# Altium schematic sheet Harvester_RF.SchDoc
size A; SheetNumber: 5
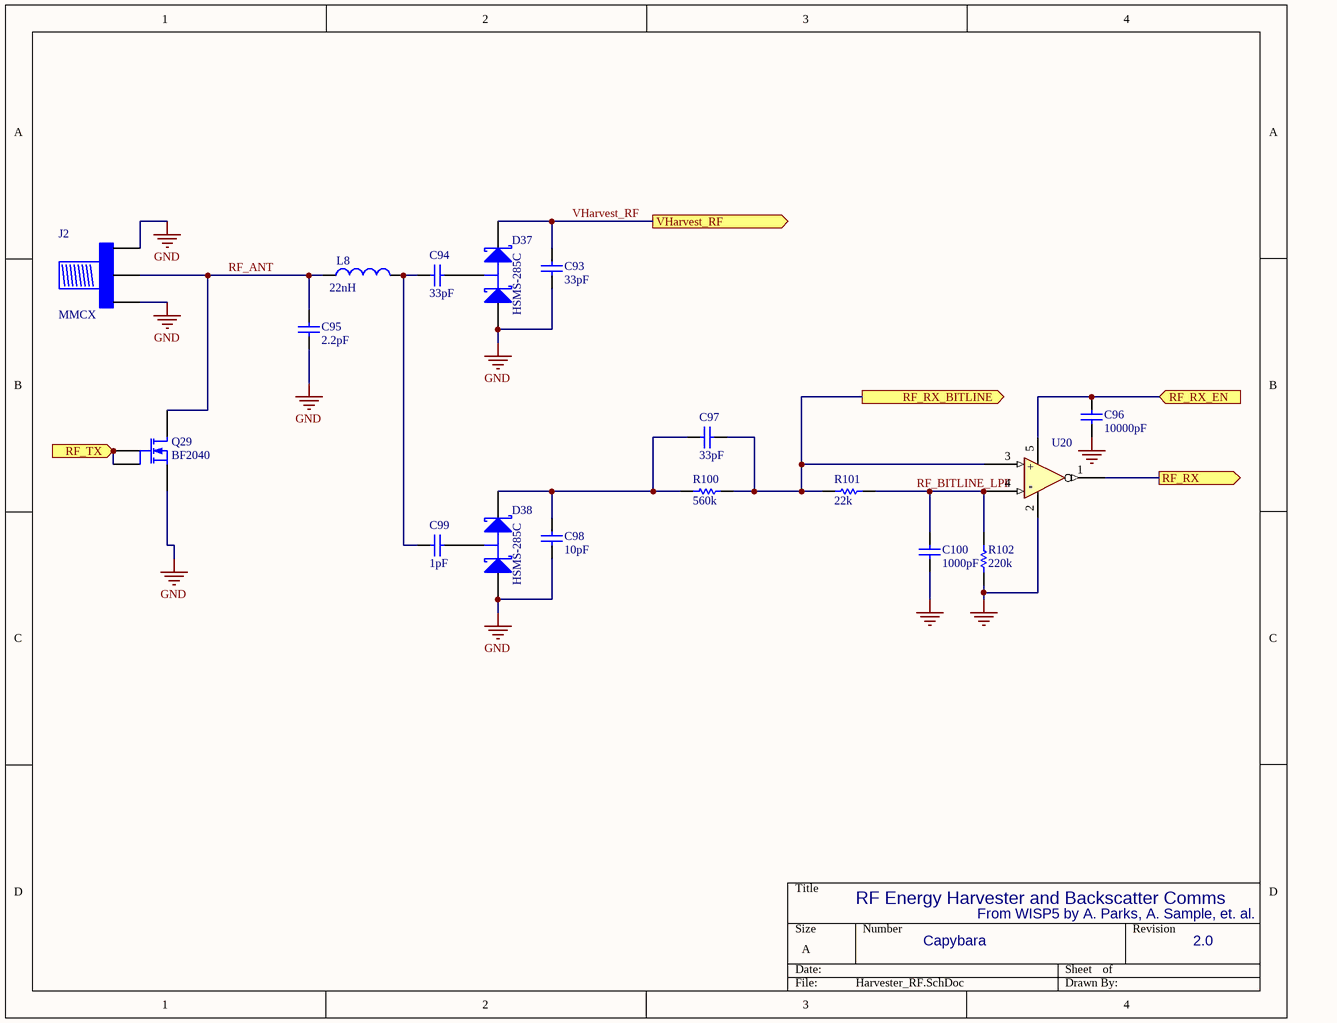
[diagram p0: Harvester_RF.SchDoc]

## Parts
C93  value 33pF  [0402]  (hidden comment: Cap)
C94  value 33pF  [0402]  (hidden comment: Cap)
C95  value 2.2pF  [0402]  (hidden comment: Cap)
C96  value 10000pF  [0402]  (hidden comment: Cap)
C97  value 33pF  [0402]  (hidden comment: Cap)
C98  value 10pF  [0402]  (hidden comment: Cap)
C99  value 1pF  [0402]  (hidden comment: Cap)
C100  value 1000pF  [0402]  (hidden comment: Cap)
D37  HSMS-285C  [SOT-323, HSMS-285C]
D38  HSMS-285C  [SOT-323, HSMS-285C]
J2  MMCX  [MMCX-TH]
L8  value 22nH  [0402]  (hidden comment: Ind)
Q29  BF2040  [SOT-143]
R100  value 560k  [0402]  (hidden comment: Res)
R101  value 22k  [0402]  (hidden comment: Res)
R102  value 220k  [0402]  (hidden comment: Res)
U20  Comparator  [SC70-5]  (value not drawn)

## Ports
RF_RX (out), RF_RX_BITLINE (out), RF_RX_EN (in), RF_TX (in), VHarvest_RF (out)

## Nets
GND: C93.2 C95.1 C96.2 C98.2 C100.2 D37.1(A) D38.1(A) J2.2 Q29.1(S) R102.2 U20.2(Gnd)
RF_ANT: C95.2 J2.1 L8.1 Q29.2(D)
RF_BITLINE_LPF: C100.1 R101.1 R102.1 U20.4(In-)
RF_RX: U20.1(OUT) ; port RF_RX
RF_RX_BITLINE: C97.2 R100.1 R101.2 U20.3(IN+) ; port RF_RX_BITLINE
RF_RX_EN: C96.1 U20.5(VDD) ; port RF_RX_EN
RF_TX: Q29.3(G2) Q29.4(G1) ; port RF_TX
VHarvest_RF: C93.1 D37.2(K) ; port VHarvest_RF
NetC94_1: C94.1 C99.1 L8.2
NetC94_2: C94.2 D37.3(C)
NetC97_1: C97.1 C98.1 D38.2(K) R100.2
NetC99_2: C99.2 D38.3(C)

## Notes on the sheet
- RF Energy Harvester and Backscatter Comms
- Capybara
- From WISP5 by A. Parks, A. Sample, et. al.
- 2.0
- (in symbol NCS2200) +; -

## Library data of the parts
C93 C94 C97 = Cap: Ceramic Capacitor (Surface Mount); Manufacturer: Johanson; Manufacturer Part Number: 500R07S330JV4T; Digi-Key Part Number: 712-1298-1-ND; Note: *; Rating: *; Distributor: Mouser; Distributor Part Number: 609-500R07S330JV4T; Mouser Part Number: 609-500R07S330JV4T
C95 = Cap: Ceramic Capacitor (Surface Mount); Manufacturer: Johanson; Manufacturer Part Number: 500R07S5R6CV4T; Digi-Key Part Number: 712-1289-1-ND; Note: *; Rating: *; Mouser Part Number: 609-500R07S5R6CV4T; Distributor: Mouser; Distributor Part Number: 609-500R07S5R6CV4T
C96 = Cap: Ceramic Capacitor (Surface Mount); Manufacturer: Murata Electronics North America; Manufacturer Part Number: GRM188R61A105KA61D; Note: *; Rating: *; Distributor: Digi-Key; Distributor Part Number: 490-1543-1-ND
C98 = Cap: Ceramic Capacitor (Surface Mount); Manufacturer: Johanson; Manufacturer Part Number: 500R07S100JV4T; Digi-Key Part Number: 712-1253-1-ND; Note: *; Rating: *; Distributor: Mouser; Distributor Part Number: 609-500R07S100JV4T; Mouser Part Number: 609-500R07S100JV4T
C99 = Cap: Ceramic Capacitor (Surface Mount); Manufacturer: Murata Electronics; Manufacturer Part Number: GJM1555C1H1R0BB01D; Digi-Key Part Number: 712-1266-1-ND; Note: *; Rating: *; Distributor: Digi-Key; Distributor Part Number: 490-6073-1-ND
C100 = Cap: Ceramic Capacitor (Surface Mount); Manufacturer: Generic Ceramic Chip Cap (TBD); Manufacturer Part Number: GRM1555C1H102JA01D; Digi-Key Part Number: 490-3244-1-ND; Note: *; Rating: *; Distributor: Mouser; Distributor Part Number: 81-GRM1555C1H102JA1D; Mouser Part Number: 81-GRM1555C1H102JA1D
D37 D38 = HSMS-285C: Agilent Schottky Diode, Two in Series, Small Package SOT-323; Manufacturer: Avago Technologies US Inc.; Manufacturer Part Number: HSMS-285C-BLKG; Note: *; Digi-Key Part Number: 516-2558-ND; Rating: *; Value: *; Distributor: Mouser; Distributor Part Number: 630-HSMS-285C-BLKG; Mouser Part Number: 630-HSMS-285C-BLKG
J2 = MMCX: MMCX RF Connector; Manufacturer Part Number: 0734151001; Manufacturer: Molex; Note: *; Digi-Key Part Number: WM5552-ND; Distributor: Mouser; Distributor Part Number: 538-73415-1001; Mouser Part Number: 538-73415-1001
L8 = Ind: Inductor (Surface Mount); Manufacturer: Coilcraft (http://www.coilcraft.com/0402cs.cfm); Manufacturer Part Number: 0402CS-22NX_LU; Rating: *; Note: *; Distributor: Mouser; Distributor Part Number: 994-0402CS-22NXGLU; Mouser Part Number: 994-0402CS-22NXGLU
Q29 = BF2040: N-Channel RF MOSFET 1GHz, 40mA; Manufacturer Part Number: BF2040E6814HTSA1; Manufacturer: NXP Semiconductors; Digi-Key Part Number: BF2040E6814HTSA1CT-ND; Rating: *; Value: *; Note: *; Distributor: Mouser; Distributor Part Number: 726-BF2040E6814HTSA1; Mouser Part Number: 726-BF2040E6814HTSA1
R100 = Res: Chip Resistor (Surface Mount); Manufacturer: Panasonic; Manufacturer Part Number: ERJ-2RKF5603X; Digi-Key Part Number: P560KLCT-ND; Rating: *; Note: *; Distributor: Digi-Key; Distributor Part Number: P560KLCT-ND
R101 = Res: Chip Resistor (Surface Mount); Manufacturer: Panasonic; Manufacturer Part Number: ERJ-2RKF2202X; Digi-Key Part Number: P22.0KLCT-ND; Rating: *; Note: *; Distributor: Digi-Key; Distributor Part Number: P22.0KLCT-ND
R102 = Res: Chip Resistor (Surface Mount); Manufacturer: Panasonic; Manufacturer Part Number: ERJ-2RKF2203X; Digi-Key Part Number: P220KLCT-ND; Rating: *; Note: *; Distributor: Digi-Key; Distributor Part Number: P220KLCT-ND
U20 = NCS2200: Comparator: On Semi 10uA Comparator; Manufacturer: ON Semiconductor; Manufacturer Part Number: NCS2200SQ2T2G; Digi-Key Part Number: NCS2200SQ2T2GOSCT-ND; Rating: *; Value: *; Note: *; Distributor: Mouser; Distributor Part Number: 863-NCS2200SQ2T2G; Mouser Part Number: 863-NCS2200SQ2T2G